# Altium project Archimajor.PrjPcb (part 3 of 3)

## Sheet Thermocouples.SchDoc
size Letter
Used 5 times, as channels T1, T2, T3, T4, T5. Parts and nets are listed once, with the designators drawn on the sheet.
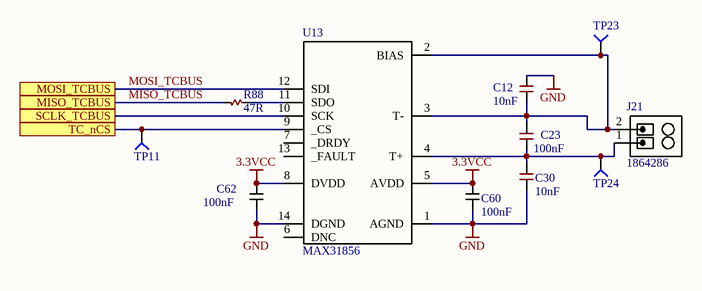
[diagram p10: Thermocouples.SchDoc]

### Parts
C12  10nF  [C0402]
C23  100nF  [C0603]
C30  10nF  [C0402]
C60  100nF  [C0201 Large Pads]
C62  100nF  [C0201 Large Pads]
J21  1864286  [1864286]
R88  47R  [R0402]
TP11  TP4  [TP-2]  (value not drawn)  (no BOM)
TP23  TP4  [TP-2]  (value not drawn)  (no BOM)
TP24  TP4  [TP-2]  (value not drawn)  (no BOM)
U13  MAX31856  [TSSOP-14L 65P640X110]

### Ports
MISO_TCBUS, MOSI_TCBUS, SCLK_TCBUS, TC_nCS

### Nets
3.3VCC: C60.2 C62.2 U13.5(AVDD) U13.8(DVDD)
GND: C12.2 C30.1 C60.1 C62.1 U13.1(AGND) U13.14(DGND)
MISO_TCBUS: R88.2 ; port MISO_TCBUS
MOSI_TCBUS: U13.12(SDI) ; port MOSI_TCBUS
SCLK_TCBUS: U13.10(SCK) ; port SCLK_TCBUS
TC_nCS: TP11.1 U13.9(_CS) ; port TC_nCS
NetC12_1: C12.1 C23.2 J21.2(S) TP23.1 U13.2(BIAS) U13.3(T-)
NetC23_1: C23.1 C30.2 J21.1(S) TP24.1 U13.4(T+)
NetR88_1: R88.1 U13.11(SDO)

Not connected (* = marked no-connect by the designer): U13 6(DNC) 7(_DRDY) 13(_FAULT)

### Channels
T1: designators end in A; ports MISO_TCBUS=MISO_TCBUS MOSI_TCBUS=MOSI_TCBUS SCLK_TCBUS=SCLK_TCBUS TC_nCS=TC_nCS1
T2: designators end in B; ports MISO_TCBUS=MISO_TCBUS MOSI_TCBUS=MOSI_TCBUS SCLK_TCBUS=SCLK_TCBUS TC_nCS=TC_nCS2
T3: designators end in C; ports MISO_TCBUS=MISO_TCBUS MOSI_TCBUS=MOSI_TCBUS SCLK_TCBUS=SCLK_TCBUS TC_nCS=TC_nCS3
T4: designators end in D; ports MISO_TCBUS=MISO_TCBUS MOSI_TCBUS=MOSI_TCBUS SCLK_TCBUS=SCLK_TCBUS TC_nCS=TC_nCS4
T5: designators end in E; ports MISO_TCBUS=MISO_TCBUS MOSI_TCBUS=MOSI_TCBUS SCLK_TCBUS=SCLK_TCBUS TC_nCS=TC_nCS5

### Notes on the sheet
- Title:
- Project:
- File:
- Ver:
- Drawn by:
- Sheet:
- of

### Library data of the parts
C12 C30 = 10nF 0402 50V X7R: CAP CER 10nF 50V X7R 0402; PART DESCRIPTION: 10000pF ±5% 50V Ceramic Capacitor X7R 0402 (1005 Metric); MANUFACTURER #: GRM155R71H103JA88D; MANUFACTURER: Murata; TOLERANCE: 5%; EE_SPEC: 50V; DISTRIBUTOR #: 490-7763-1-ND; DISTRIBUTOR: Digikey; PART: 10nF 50V X7R 0402; VALUE: 10nF
C23 = 100nF 0603 50V X7R: CAP CER 0603 100nF 50V 10% X7R; MANUFACTURER: Kemet; MANUFACTURER #: C0603C104K5RACTU; PART: 100nF 50V X7R 0603; PART DESCRIPTION: 0.10µF ±10% 50V Ceramic Capacitor X7R 0603 (1608 Metric); DISTRIBUTOR #: 399-5089-2-ND; DISTRIBUTOR: Digikey; TOLERANCE: 10%; EE_SPEC: 50V; VALUE: 100nF
C60 C62 = 100nF 6.3V X5R 0201: CAP CER 0.1UF 6.3V 10% X5R 0201; MANUFACTURER: Samsung; MANUFACTURER #: CL03A104KQ3NNNC; VALUE: 100nF; DISTRIBUTOR: DIGI-KEY; DISTRIBUTOR #: 1276-1013-1-ND; TOLERANCE: 10%; VOLTAGE: 6.3V
J21 = 2POS 45DEG 3.5MM Push-Spring Terminal Block: TERM BLOCK 2POS 45DEG 3.5MM PCB; MANUFACTURER: Phoenix Contact; PART DESCRIPTION: 2 Positions Header Connector 0.100" (2.54mm) Through Hole, Right Angle Gold; TOLERANCE: -NA-; MANUFACTURER #: 1864286; DISTRIBUTOR #: 277-12184-ND; DISTRIBUTOR: Digikey; PART: 1864286; EE_SPEC: -NA-; VALUE: 1864286
R88 = 47R 1% 0402: RES 47 OHM 1% 1/16W 0402; MANUFACTURER: Vishay Dale; MANUFACTURER #: CRCW040247R0FKEDC; Part Description: 47 Ohms ±1% 0.063W, 1/16W Chip Resistor 0402 (1005 Metric)  Thick Film; Tolerance: +/- 1%; VALUE: 47R; EE_SPEC: 47R 1% 0402
TP11 TP23 TP24 = Socket: MANUFACTURER #: NOTAPART-Testpoint
U13 = MAX31856: IC CONV THERMOCOUPLE 14TSSOP; MANUFACTURER: Maxim; MANUFACTURER #: MAX31856MUD; VOLTAGE: 3.3V; PART: MAX31856

## Nets that join several sheets
3.3VCC: M1 (5 pins), M2 (5 pins), M3 (5 pins), M4 (5 pins), Power (C24.1 R33.2 TP47.1 U8.4), Thermistors (6 pins), Fans (9 pins), Connectors (R197.2 R198.2), EndStops (24 pins), Microcontroller (41 pins), USB (7 pins), M5 (5 pins), M6 (5 pins), M7 (5 pins), M8 (5 pins), T1 (C60A.2 C62A.2 U13A.5 U13A.8), T2 (C60B.2 C62B.2 U13B.5 U13B.8), T3 (C60C.2 C62C.2 U13C.5 U13C.8), T4 (C60D.2 C62D.2 U13D.5 U13D.8), T5 (C60E.2 C62E.2 U13E.5 U13E.8)
+5VCC: M1 (P2A.1), M2 (P2B.1), M3 (P2C.1), M4 (P2D.1), Mosfets (10 pins), Power (8 pins), Fans (C92.2 U2.14), Microcontroller (8 pins), USB (JP1.1 R150.2 R151.2), M5 (P2E.1), M6 (P2F.1), M7 (P2G.1), M8 (P2H.1)
GND: M1 (30 pins), M2 (30 pins), M3 (30 pins), M4 (30 pins), Mosfets (34 pins), Power (69 pins), Thermistors (9 pins), Fans (22 pins), Connectors (J24.3), EndStops (24 pins), Microcontroller (101 pins), USB (23 pins), M5 (30 pins), M6 (30 pins), M7 (30 pins), M8 (30 pins), T1 (6 pins), T2 (6 pins), T3 (6 pins), T4 (6 pins), T5 (6 pins)
VBED: Mosfets (C11.1 D15.C R9.2), Power (8 pins)
VDDANA: Microcontroller (5 pins), USB (C76.1 C77.1 U11#2.75)
VFAN: Power (P1.1 P1.3 R103.2), Fans (13 pins)
VMOT: M1 (11 pins), M2 (11 pins), M3 (11 pins), M4 (11 pins), Power (7 pins)
VMOT: Power (7 pins), M5 (11 pins), M6 (11 pins), M7 (11 pins), M8 (11 pins)
VPWR: Mosfets (12 pins), Power (21 pins)
DIAG1: M1 (R108A.2 U15A.27), Microcontroller (U11#1.63)
DIAG2: M2 (R108B.2 U15B.27), Microcontroller (U11#1.93)
DIAG3: M3 (R108C.2 U15C.27), Microcontroller (U11#1.97)
DIAG4: M4 (R108D.2 U15D.27), Microcontroller (U11#1.101)
DIAG5: Microcontroller (U11#1.131), M5 (R108E.2 U15E.27)
DIAG6: Microcontroller (U11#1.142), M6 (R108F.2 U15F.27)
DIAG7: Microcontroller (U11#1.3), M7 (R108G.2 U15G.27)
DIAG8: Microcontroller (U11#1.4), M8 (R108H.2 U15H.27)
DIR: M1 (P2A.7 U15A.18), Microcontroller (U11#1.64)
DIR: M2 (P2B.7 U15B.18), Microcontroller (U11#1.94)
DIR: M3 (P2C.7 U15C.18), Microcontroller (U11#1.98)
DIR: M4 (P2D.7 U15D.18), Microcontroller (U11#1.116)
DIR: Microcontroller (U11#1.121), M7 (P2G.7 U15G.18)
DIR: Microcontroller (U11#1.141), M5 (P2E.7 U15E.18)
DIR: Microcontroller (U11#1.143), M6 (P2F.7 U15F.18)
DIR: Microcontroller (U11#1.14), M8 (P2H.7 U15H.18)
DRV_EN: M1 (U15A.28), M2 (U15B.28), M3 (U15C.28), M4 (U15D.28), Microcontroller (U11#1.67), M5 (U15E.28), M6 (U15F.28), M7 (U15G.28), M8 (U15H.28)
Fan1: Fans (R183.1 U2.12), Microcontroller (U11#1.137)
Fan2: Fans (R182.1 U2.9), Microcontroller (U11#1.136)
Fan3: Fans (R171.1 U2.5), Microcontroller (U11#1.76)
Fan4: Fans (R101.1 U2.2), Microcontroller (U11#1.77)
Heat1: Mosfets (R54.2 U10.2), Microcontroller (U11#1.132)
Heat2: Mosfets (R39.2 U10.12), Microcontroller (U11#1.133)
Heat3: Mosfets (R29.2 U10.5), Microcontroller (U11#1.135)
HeatBed: Mosfets (R30.2 U10.9), Microcontroller (U11#1.134)
HTBD-OUT: Mosfets (6 pins), Power (J3.10)
M_nCS: M1 (P2A.3 U15A.13), Microcontroller (D70.K U11#1.83)
M_nCS: M2 (P2B.3 U15B.13), Microcontroller (D74.K U11#1.96)
M_nCS: M3 (P2C.3 U15C.13), Microcontroller (D75.K U11#1.100)
M_nCS: M4 (P2D.3 U15D.13), Microcontroller (D76.K U11#1.128)
M_nCS: Microcontroller (D40.K U11#1.119), M6 (P2F.3 U15F.13)
M_nCS: Microcontroller (D60.K U11#1.120), M5 (P2E.3 U15E.13)
M_nCS: Microcontroller (D41.K U11#1.13), M7 (P2G.3 U15G.13)
M_nCS: Microcontroller (D63.K U11#1.15), M8 (P2H.3 U15H.13)
MAX_ES1: EndStops (C86.1 R23.1 R35.1), Microcontroller (U11#1.32)
MAX_ES2: EndStops (C158.1 R73.1 R74.1), Microcontroller (U11#1.18)
MAX_ES3: EndStops (C160.1 R78.1 R79.1), Microcontroller (U11#1.22)
MAX_ES4: EndStops (C216.1 R192.1 R193.1), Microcontroller (U11#1.122)
MIN_ES1: EndStops (C84.1 R19.1 R22.1), Microcontroller (U11#1.17)
MIN_ES2: EndStops (C157.1 R63.1 R72.1), Microcontroller (U11#1.19)
MIN_ES3: EndStops (C159.1 R75.1 R76.1), Microcontroller (U11#1.26)
MIN_ES4: EndStops (C214.1 R190.1 R191.1), Microcontroller (U11#1.140)
MISO_M1BUS: M1 (R86A.1), M2 (R86B.1), M3 (R86C.1), M4 (R86D.1), Microcontroller (C75.1 U12.2 U16.5)
MISO_M2BUS: Microcontroller (C87.1 U16.9), M5 (R86E.1), M6 (R86F.1), M7 (R86G.1), M8 (R86H.1)
MISO_TCBUS: Microcontroller (C74.1 U16.2), T1 (R88A.2), T2 (R88B.2), T3 (R88C.2), T4 (R88D.2), T5 (R88E.2)
MOSI_M1BUS: M1 (U15A.15), M2 (U15B.15), M3 (U15C.15), M4 (U15D.15), Microcontroller (C88.1 R59.1 U12.5)
MOSI_M2BUS: Microcontroller (C89.1 R89.1), M5 (U15E.15), M6 (U15F.15), M7 (U15G.15), M8 (U15H.15)
MOSI_TCBUS: Microcontroller (C83.1 R84.1), T1 (U13A.12), T2 (U13B.12), T3 (U13C.12), T4 (U13D.12), T5 (U13E.12)
MOT_SD_MODE: M1 (U15A.21), M2 (U15B.21), M3 (U15C.21), M4 (U15D.21), Connectors (J24.1 R197.1), M5 (U15E.21), M6 (U15F.21), M7 (U15G.21), M8 (U15H.21)
MOT_SPI_MODE: M1 (U15A.22), M2 (U15B.22), M3 (U15C.22), M4 (U15D.22), Connectors (J24.2 R198.1), M5 (U15E.22), M6 (U15F.22), M7 (U15G.22), M8 (U15H.22)
NRST: Microcontroller (D71.C J20.18 J28.6 R145.2), USB (R149.1)
RESET: Microcontroller (C40.1 J4.10 S1.1 TP56.1), USB (U11#2.47)
SCLK_M1BUS: M1 (U15A.14), M2 (U15B.14), M3 (U15C.14), M4 (U15D.14), Microcontroller (C104.2 R13.1 U12.6)
SCLK_M2BUS: Microcontroller (C85.2 R32.1), M5 (U15E.14), M6 (U15F.14), M7 (U15G.14), M8 (U15H.14)
SCLK_TCBUS: Microcontroller (C101.2 R3.1), T1 (U13A.10), T2 (U13B.10), T3 (U13C.10), T4 (U13D.10), T5 (U13E.10)
STEP: M1 (P2A.5 U15A.17), Microcontroller (U11#1.65)
STEP: M2 (P2B.5 U15B.17), Microcontroller (U11#1.95)
STEP: M3 (P2C.5 U15C.17), Microcontroller (U11#1.99)
STEP: M4 (P2D.5 U15D.17), Microcontroller (U11#1.117)
STEP: Microcontroller (U11#1.118), M5 (P2E.5 U15E.17)
STEP: Microcontroller (U11#1.123), M7 (P2G.5 U15G.17)
STEP: Microcontroller (U11#1.1), M6 (P2F.5 U15F.17)
STEP: Microcontroller (U11#1.16), M8 (P2H.5 U15H.17)
TACH_1: Fans (C155.1 R174.1), Microcontroller (U11#1.139)
TACH_2: Fans (C156.1 R176.1), Microcontroller (U11#1.21)
TACH_3: Fans (C212.1 R186.1), Microcontroller (U11#1.20)
TACH_4: Fans (C213.1 R188.1), Microcontroller (U11#1.102)
TC_nCS1: Microcontroller (D61.K U11#1.138), T1 (TP11A.1 U13A.9)
TC_nCS2: Microcontroller (D30.K U11#1.127), T2 (TP11B.1 U13B.9)
TC_nCS3: Microcontroller (D31.K U11#1.82), T3 (TP11C.1 U13C.9)
TC_nCS4: Microcontroller (D5.K U11#1.85), T4 (TP11D.1 U13D.9)
TC_nCS5: Microcontroller (D62.K U11#1.88), T5 (TP11E.1 U13E.9)
THERM_AN1: Thermistors (C103.1 R44.1 TP101.1), Microcontroller (U11#1.90)
THERM_AN2: Thermistors (C161.1 R81.1 TP9.1), Microcontroller (U11#1.89)
THERM_AN3: Thermistors (C162.1 R91.1 TP10.1), Microcontroller (U11#1.91)